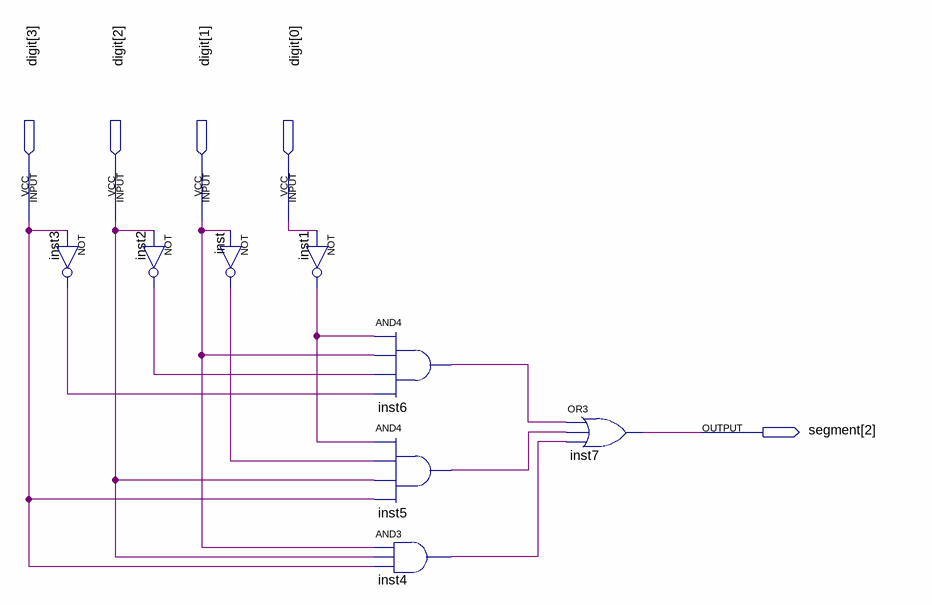
[diagram p0: schematic sheet]
// Quartus schematic segmentC.bdf as structural Verilog: 8 symbols, 5 pins
module segmentC (
  input  [3:0] digit,
  output [2:2] segment
);

  wire inst1_out, inst2_out, inst3_out, inst4_out, inst5_out, inst6_out, inst_out;

  not inst3 (inst3_out, digit[3]);
  not inst2 (inst2_out, digit[2]);
  not inst (inst_out, digit[1]);
  not inst1 (inst1_out, digit[0]);
  and inst6 (inst6_out, inst1_out, digit[1], inst2_out, inst3_out);
  and inst5 (inst5_out, inst1_out, inst_out, digit[2], digit[3]);
  and inst4 (inst4_out, digit[1], digit[2], digit[3]);
  or inst7 (segment[2], inst6_out, inst5_out, inst4_out);
endmodule
